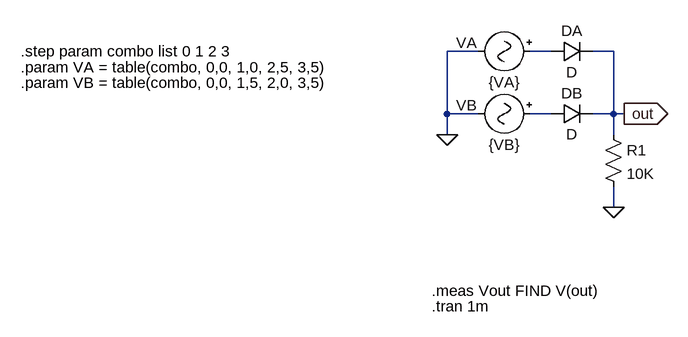
[diagram p0: schematic or_gate_diode.asc]
or_gate_diode.asc, the LTspice schematic file:
Version 4.1
SHEET 1 880 680
WIRE -48 144 -96 144
WIRE 64 144 32 144
WIRE 160 144 128 144
WIRE -96 240 -96 144
WIRE -48 240 -96 240
WIRE 64 240 32 240
WIRE 160 240 160 144
WIRE 160 240 128 240
WIRE 176 240 160 240
WIRE -96 272 -96 240
WIRE 160 272 160 240
WIRE 160 384 160 352
FLAG -96 272 0
FLAG 176 240 out
IOPIN 176 240 Out
FLAG 160 384 0
SYMBOL diode 64 160 R270
WINDOW 0 32 32 VTop 2
WINDOW 3 0 32 VBottom 2
SYMATTR InstName DA
SYMBOL diode 64 256 R270
WINDOW 0 32 32 VTop 2
WINDOW 3 0 32 VBottom 2
SYMATTR InstName DB
SYMBOL res 144 256 R0
SYMATTR InstName R1
SYMATTR Value 10K
SYMBOL Misc\\signal 48 144 R90
WINDOW 0 2 114 VBottom 2
WINDOW 3 32 56 VTop 2
SYMATTR InstName VA
SYMATTR Value {VA}
SYMBOL Misc\\signal 48 240 R90
WINDOW 0 2 114 VBottom 2
WINDOW 3 32 56 VTop 2
WINDOW 123 0 0 Left 0
WINDOW 39 0 0 Left 0
SYMATTR InstName VB
SYMATTR Value {VB}
TEXT -752 168 Left 2 !.param VA = table(combo, 0,0, 1,0, 2,5, 3,5)
TEXT -752 192 Left 2 !.param VB = table(combo, 0,0, 1,5, 2,0, 3,5)
TEXT -120 512 Left 2 !.meas Vout FIND V(out)
TEXT -752 144 Left 2 !.step param combo list 0 1 2 3
TEXT -120 536 Left 2 !.tran 1m

The netlist it stands for:
* or_gate_diode.asc
DA N001 out D
DB N002 out D
R1 out 0 10K
VA N001 0 {VA}
VB N002 0 {VB}
.model D D
.lib standard.dio
.param VA = table(combo, 0,0, 1,0, 2,5, 3,5)
.param VB = table(combo, 0,0, 1,5, 2,0, 3,5)
.meas Vout FIND V(out)
.step param combo list 0 1 2 3
.tran 1m
.backanno
.end